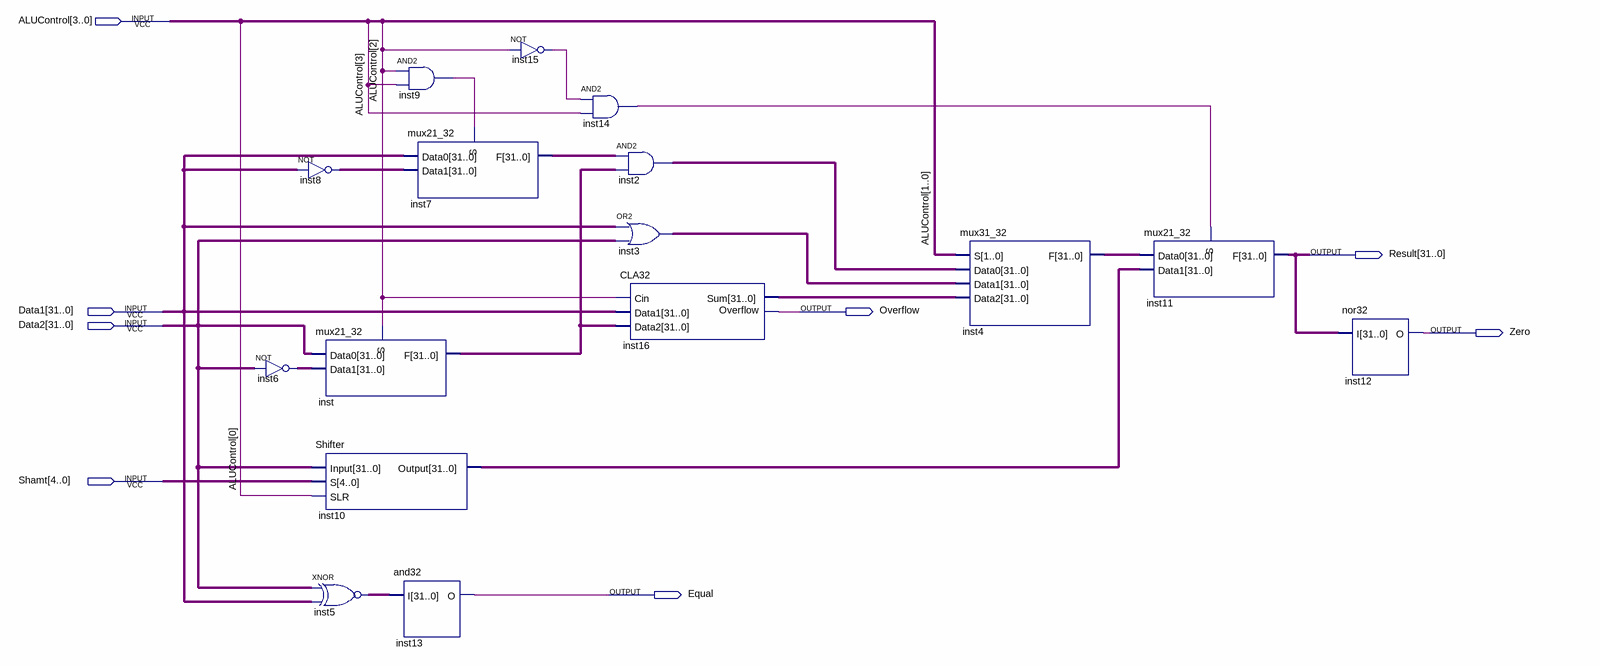
[diagram p0: schematic sheet]
// Quartus schematic ALU.bdf as structural Verilog: 16 symbols, 8 pins
module ALU (
  input  [3:0] ALUControl,
  input  [31:0] Data1,
  input  [31:0] Data2,
  input  [4:0] Shamt,
  output [31:0] Result,
  output Overflow,
  output Zero,
  output Equal
);

  wire inst9_out, inst14_out, inst15_out;
  wire [31:0] inst2_out, inst3_out, inst4_f, inst5_out, inst6_out, inst7_f, inst8_out, inst10_output,
       inst16_sum, inst_f;

  assign inst6_out = ~Data2;  // NOT inst6, 32 bits wide
  assign inst8_out = ~Data1;  // NOT inst8, 32 bits wide
  mux21_32 inst (.Data0(Data2), .Data1(inst6_out), .S(ALUControl[2]), .F(inst_f));
  Shifter inst10 (.Input(Data2), .S(Shamt), .SLR(ALUControl[0]), .Output(inst10_output));
  assign inst5_out = ~(Data2 ^ Data1);  // XNOR inst5, 32 bits wide
  and inst9 (inst9_out, ALUControl[2], ALUControl[3]);
  mux21_32 inst7 (.Data0(Data1), .Data1(inst8_out), .S(inst9_out), .F(inst7_f));
  and32 inst13 (.I(inst5_out), .O(Equal));
  not inst15 (inst15_out, ALUControl[2]);
  and inst14 (inst14_out, inst15_out, ALUControl[3]);
  assign inst2_out = inst7_f & inst_f;  // AND2 inst2, 32 bits wide
  assign inst3_out = Data1 | Data2;  // OR2 inst3, 32 bits wide
  CLA32 inst16 (.Cin(ALUControl[2]), .Data1(Data1), .Data2(inst_f), .Sum(inst16_sum), .Overflow(Overflow));
  mux31_32 inst4 (.S(ALUControl[1:0]), .Data0(inst2_out), .Data1(inst3_out), .Data2(inst16_sum), .F(inst4_f));
  mux21_32 inst11 (.Data0(inst4_f), .Data1(inst10_output), .S(inst14_out), .F(Result));
  nor32 inst12 (.I(Result), .O(Zero));
endmodule
